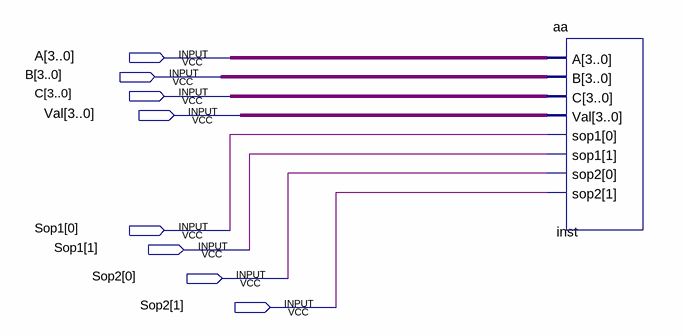
[diagram p0: schematic sheet]
// Quartus schematic Block22.bdf as structural Verilog: 1 symbols, 8 pins
module Block22 (
  input  [3:0] A,
  input  [3:0] B,
  input  [3:0] C,
  input  [3:0] Val,
  input  [1:0] Sop1,
  input  [1:0] Sop2
);

  aa inst (.A(A), .B(B), .C(C), .Val(Val), .sop1(Sop1), .sop2(Sop2));
endmodule
